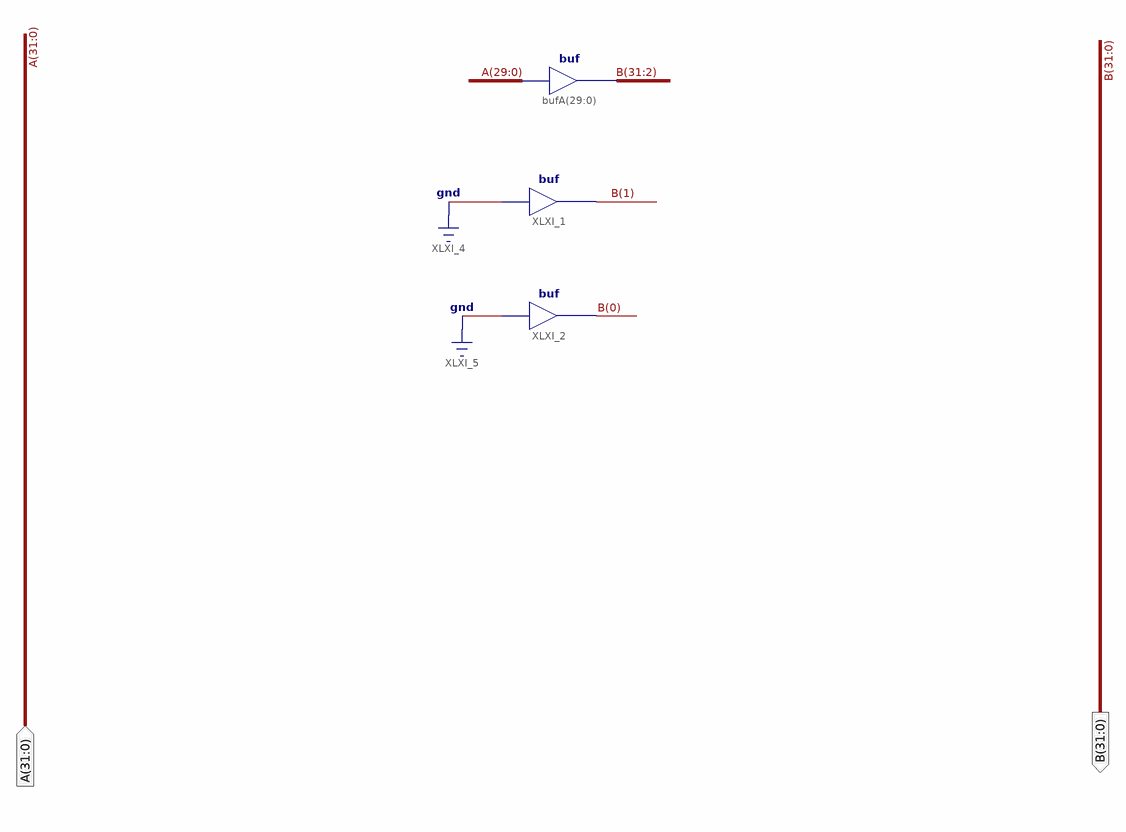
[diagram p0: schematic sheet 1]
// Xilinx ISE schematic left2_shift.sch (artix7) as structural Verilog: 3 symbols, 2 ports
module left2_shift (
  input  [31:0] A,
  output [31:0] B
);

  buf XLXI_1 (B[1], 1'b0);
  buf XLXI_2 (B[0], 1'b0);
  assign B[31:2] = A[29:0];  // buf bufA[29..0], 30 bits wide
endmodule
